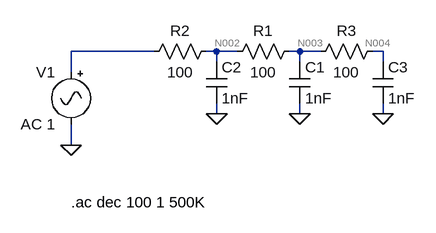
[diagram p0: schematic loopFilter.asc]
loopFilter.asc, the LTspice schematic file:
Version 4
SHEET 1 880 680
WIRE 160 96 32 96
WIRE 256 96 240 96
WIRE 288 96 256 96
WIRE 384 96 368 96
WIRE 416 96 384 96
WIRE 512 96 496 96
WIRE 256 112 256 96
WIRE 384 112 384 96
WIRE 512 112 512 96
WIRE 32 128 32 96
WIRE 256 192 256 176
WIRE 384 192 384 176
WIRE 512 192 512 176
WIRE 32 240 32 208
FLAG 32 240 0
FLAG 256 192 0
FLAG 384 192 0
FLAG 512 192 0
SYMBOL Misc\\signal 32 112 M0
SYMATTR InstName V1
SYMATTR Value AC 1
SYMBOL cap 240 112 R0
SYMATTR InstName C2
SYMATTR Value 1nF
SYMBOL res 144 112 R270
WINDOW 0 32 56 VTop 2
WINDOW 3 0 56 VBottom 2
SYMATTR InstName R2
SYMATTR Value 100
SYMBOL res 272 112 R270
WINDOW 0 32 56 VTop 2
WINDOW 3 0 56 VBottom 2
SYMATTR InstName R1
SYMATTR Value 100
SYMBOL cap 368 112 R0
SYMATTR InstName C1
SYMATTR Value 1nF
SYMBOL res 400 112 R270
WINDOW 0 32 56 VTop 2
WINDOW 3 0 56 VBottom 2
SYMATTR InstName R3
SYMATTR Value 100
SYMBOL cap 496 112 R0
SYMATTR InstName C3
SYMATTR Value 1nF
TEXT 32 328 Left 2 !.ac dec 100 1 500K

The netlist it stands for:
* loopFilter.asc
V1 N001 0 AC 1
C2 N002 0 1nF
R2 N001 N002 100
R1 N002 N003 100
C1 N003 0 1nF
R3 N003 N004 100
C3 N004 0 1nF
.ac dec 100 1 500K
.backanno
.end

* Results of the author's LTspice run, read from the files saved beside the schematic
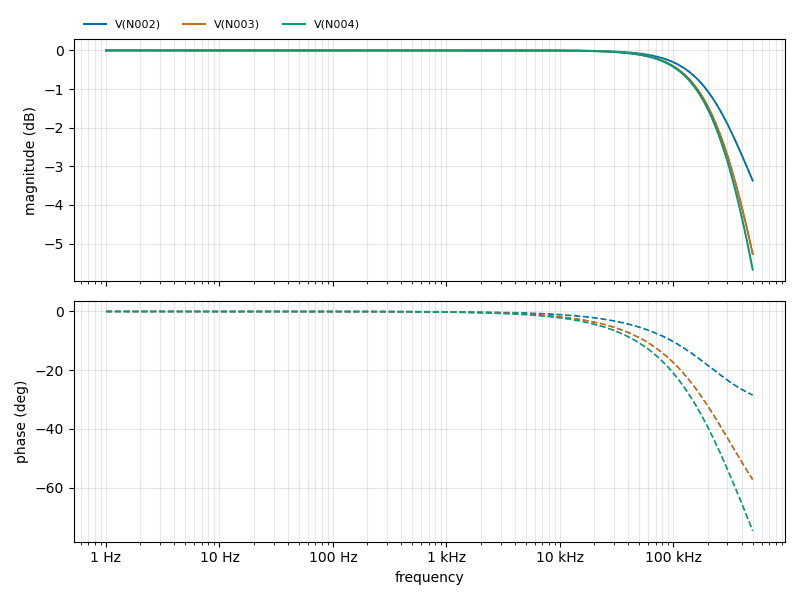
[diagram p1: AC Analysis of loopFilter.asc, plotted from the saved traces]
* AC Analysis, 1 run:
*   V(N002): -0.00 dB at 1 Hz, -3.37 dB at 500 kHz, peak -0.00 dB at 1 Hz, 3 dB below the peak at 443.8 kHz
*   V(N003): -0.00 dB at 1 Hz, -5.27 dB at 500 kHz, peak -0.00 dB at 1 Hz, 3 dB below the peak at 321.3 kHz
*   V(N004): -0.00 dB at 1 Hz, -5.67 dB at 500 kHz, peak -0.00 dB at 1 Hz, 3 dB below the peak at 309.2 kHz